# EAGLE design binary_clock (EAGLE 7.7.0)
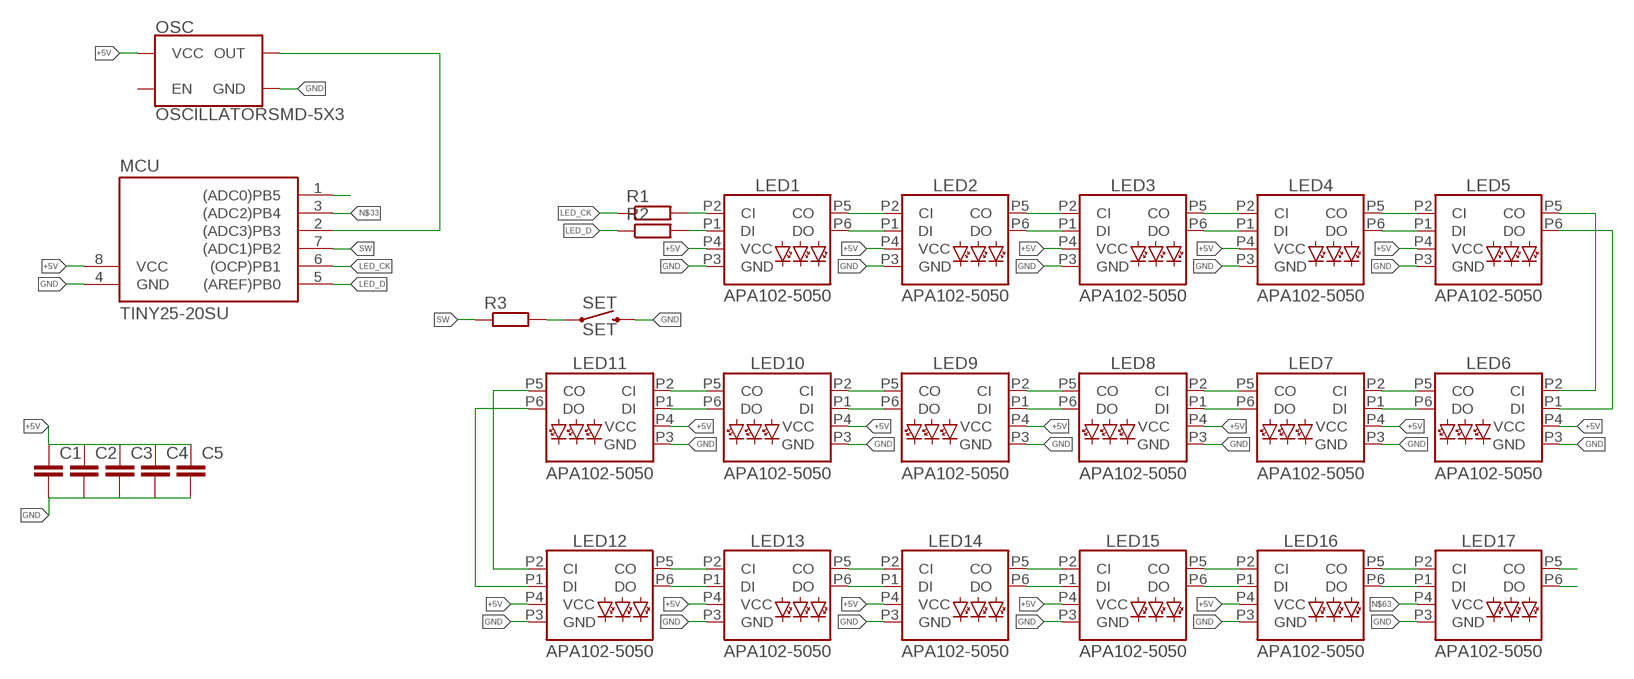
[diagram p0: schematic, sheet 1]

## Parts
C1  C-EUC0603K  [C0603K]
C2  C-EUC0603K  [C0603K]
C3  C-EUC0603K  [C0603K]
C4  C-EUC0603K  [C0603K]
C5  C-EUC0603K  [C0603K]
LED1  APA102-5050  [APA102-5050]
LED2  APA102-5050  [APA102-5050]
LED3  APA102-5050  [APA102-5050]
LED4  APA102-5050  [APA102-5050]
LED5  APA102-5050  [APA102-5050]
LED6  APA102-5050  [APA102-5050]
LED7  APA102-5050  [APA102-5050]
LED8  APA102-5050  [APA102-5050]
LED9  APA102-5050  [APA102-5050]
LED10  APA102-5050  [APA102-5050]
LED11  APA102-5050  [APA102-5050]
LED12  APA102-5050  [APA102-5050]
LED13  APA102-5050  [APA102-5050]
LED14  APA102-5050  [APA102-5050]
LED15  APA102-5050  [APA102-5050]
LED16  APA102-5050  [APA102-5050]
LED17  APA102-5050  [APA102-5050]
MCU  TINY25-20SU  [SOIC8]
OSC  OSCILLATORSMD-5X3  [OSCILLATOR-SMD-5X3.2]
R1  R-EU_R1206  [R1206]
R2  R-EU_R1206  [R1206]
R3  R-EU_R1206  [R1206]
SET  SET  MOMENTARY-SWITCH-SPST-SMD-5.2-REDUNDANT  [TACTILE_SWITCH_SMD_5.2MM]

## Nets
+5V: C1.1 C2.1 C3.1 C4.1 C5.1 LED1.P4(VCC) LED2.P4(VCC) LED3.P4(VCC) LED4.P4(VCC) LED5.P4(VCC) LED6.P4(VCC) LED7.P4(VCC) LED8.P4(VCC) LED9.P4(VCC) LED10.P4(VCC) LED11.P4(VCC) LED12.P4(VCC) LED13.P4(VCC) LED14.P4(VCC) LED15.P4(VCC) LED16.P4(VCC) MCU.8(VCC) OSC.4(VCC)
GND: C1.2 C2.2 C3.2 C4.2 C5.2 LED1.P3(GND) LED2.P3(GND) LED3.P3(GND) LED4.P3(GND) LED5.P3(GND) LED6.P3(GND) LED7.P3(GND) LED8.P3(GND) LED9.P3(GND) LED10.P3(GND) LED11.P3(GND) LED12.P3(GND) LED13.P3(GND) LED14.P3(GND) LED15.P3(GND) LED16.P3(GND) LED17.P3(GND) MCU.4(GND) OSC.2(GND) SET.3 SET.4
LED_CK: MCU.6((OCP)PB1) R1.1
LED_D: MCU.5((AREF)PB0) R2.1
N$1: LED1.P5(CO) LED2.P2(CI)
N$2: LED1.P6(DO) LED2.P1(DI)
N$3: LED2.P5(CO) LED3.P2(CI)
N$4: LED2.P6(DO) LED3.P1(DI)
N$5: LED3.P5(CO) LED4.P2(CI)
N$6: LED3.P6(DO) LED4.P1(DI)
N$7: LED4.P5(CO) LED5.P2(CI)
N$8: LED4.P6(DO) LED5.P1(DI)
N$9: LED10.P5(CO) LED11.P2(CI)
N$10: LED10.P6(DO) LED11.P1(DI)
N$11: LED9.P6(DO) LED10.P1(DI)
N$12: LED9.P5(CO) LED10.P2(CI)
N$13: LED8.P6(DO) LED9.P1(DI)
N$14: LED8.P5(CO) LED9.P2(CI)
N$15: LED7.P6(DO) LED8.P1(DI)
N$16: LED7.P5(CO) LED8.P2(CI)
N$17: LED6.P6(DO) LED7.P1(DI)
N$18: LED6.P5(CO) LED7.P2(CI)
N$19: LED11.P6(DO) LED12.P1(DI)
N$20: LED11.P5(CO) LED12.P2(CI)
N$21: LED12.P5(CO) LED13.P2(CI)
N$22: LED12.P6(DO) LED13.P1(DI)
N$23: LED13.P5(CO) LED14.P2(CI)
N$24: LED13.P6(DO) LED14.P1(DI)
N$25: LED14.P5(CO) LED15.P2(CI)
N$26: LED14.P6(DO) LED15.P1(DI)
N$27: LED15.P5(CO) LED16.P2(CI)
N$28: LED15.P6(DO) LED16.P1(DI)
N$29: LED16.P5(CO) LED17.P2(CI)
N$30: LED16.P6(DO) LED17.P1(DI)
N$31: LED17.P6(DO)
N$32: MCU.1((ADC0)PB5)
N$33: MCU.3((ADC2)PB4)
N$34: LED17.P5(CO)
N$35: MCU.2((ADC3)PB3) OSC.3(OUT)
N$36: R3.2 SET.1 SET.2
N$37: LED5.P6(DO) LED6.P1(DI)
N$38: LED5.P5(CO) LED6.P2(CI)
N$41: LED1.P1(DI) R2.2
N$42: LED1.P2(CI) R1.2
N$63: LED17.P4(VCC)
SW: MCU.7((ADC1)PB2) R3.1
Unconnected: OSC.1(EN)

## Library data of the parts
C1-C5 = rcl:C-EU: CAPACITOR, European symbol
LED1-LED17 = SparkFun-LED:APA102: APA102 Addressable RGB LED Used in manufacturing of various products at SparkFun Packages: 5050 2020 SparkFun Products: SparkFun Lumenati Boards <https://www.sparkfun.com/categories/405>; PROD_ID: DIO-13739
MCU = avr-4:TINY25
OSC = SparkFun-Clocks:OSCILLATOR: Oscillators (Generic) These are active oscillators, which require a power source to generate their clock output. Most oscillators are configured to generate a set frequency (e.g. 16MHz). They have four pins: power, ground, output, and an enable input.
R1-R3 = rcl:R-EU_: RESISTOR, European symbol
SET = SparkFun-Switches:MOMENTARY-SWITCH-SPST: Momentary Switch (Pushbutton) - SPST Normally-open (NO) SPST momentary switches (buttons, pushbuttons). Variants PTH-12MM - 12mm square, through-hole Momentary Pushbutton Switch - 12mm Square <https://www.sparkfun.com/products/9190> (COM-09190) PTH-6.0MM, PTH-6.0MM-KIT - 6.0mm square, through-hole Mini Pushbutton Switch <https://www.sparkfun.com/products/97> (COM-00097) KIT package intended for soldering kit's - only one side of pads' copper is exposed. PTH-RIGHT-ANGLE-KIT - Right-angle, through-hole Right Angle Tactile Button <https://www.sparkfun.com/products/10791> - Used on SparkFun BigTime Watch Kit <https://www.sparkfun.com/products/11734> SMD-12MM - 12mm square, surface-mount Tactile Button - SMD (12mm) <https://www.sparkfun.com/products/12993> (COM-12993) Used on SparkFun PicoBoard <https://www.sparkfun.com/products/11888> SMD-4.5MM - 4.5mm Square Trackball Switch Used on SparkFun Blackberry Trackballer Breakout <https://www.sparkfun.com/products/13169> SMD-4.6MMX2.8MM - 4.60mm x 2.80mm, surface mount Used on SparkFun SAMD21 Mini Breakout <https://www.sparkfun.com/products/13664> SMD-5.2MM, SMD-5.2-REDUNDANT - 5.2mm square, surface-mount Mini Pushbutton Switch - SMD <https://www.sparkfun.com/products/8720> (COM-08720) Used on Arduino Pro Mini <https://www.sparkfun.com/products/11114> REDUNDANT package connects both switch circuits together SMD-6.0X3.5MM - 6.0 x 3.5mm, surface mount Momentary Reset Switch SMD <https://www.sparkfun.com/products/8229> (COM-08229) SMD-6.2MM-TALL - 6.2mm square, surface mount Tactile Button - SMD (6mm) <https://www.sparkfun.com/products/12992> Used on SparkFun Digital Sandbox <https://www.sparkfun.com/products/12651> SMD-RIGHT-ANGLE - Right-angle, surface mount Used on SparkFun Block for Intel® Edison - Arduino <https://www.sparkfun.com/products/13036>; PROD_ID: SWCH-08247; SF_SKU: COM-08720

## Board
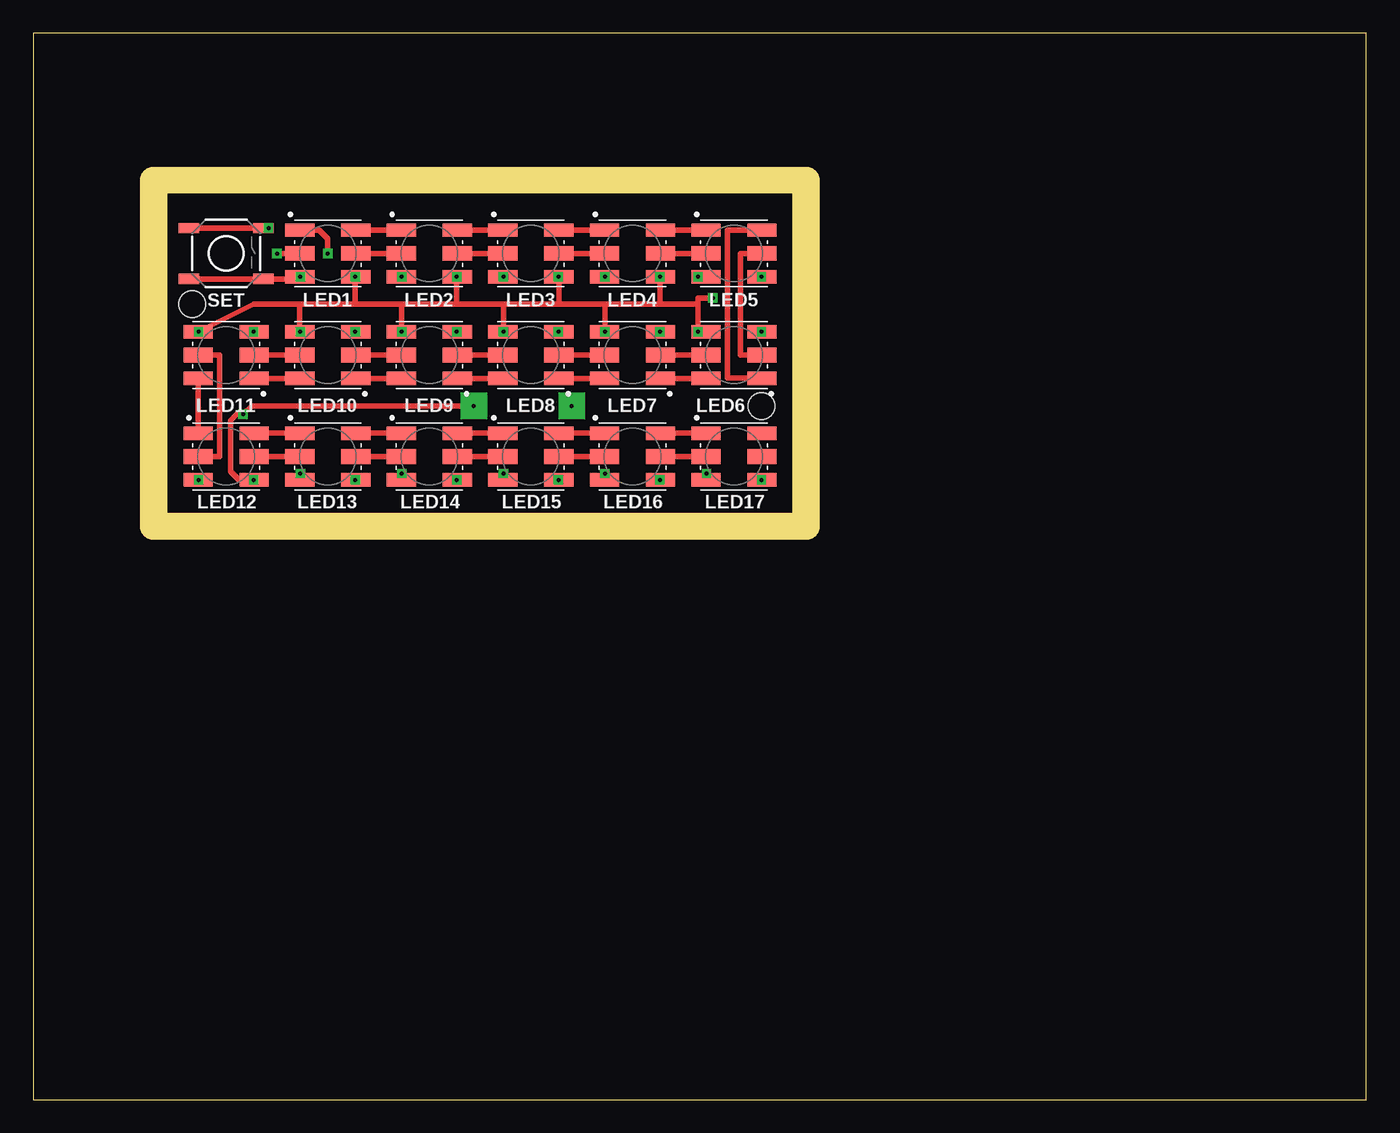
[diagram p1: board, top side]
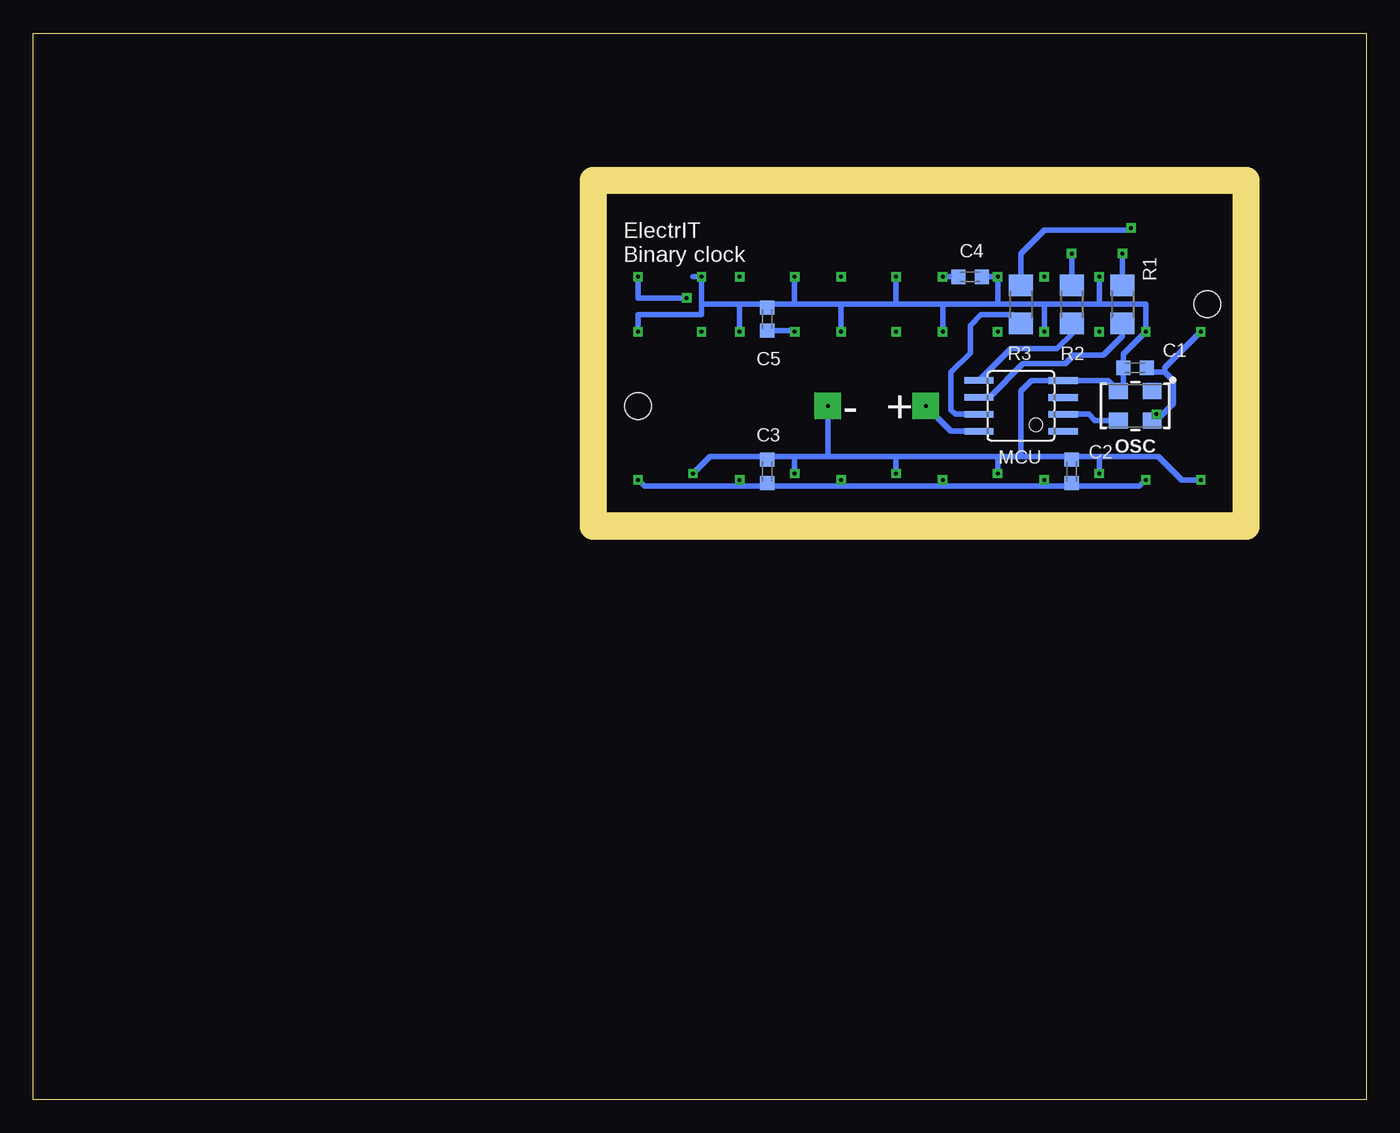
[diagram p2: board, bottom side, seen from below]

Size 100 x 80 mm. Coordinates in mm from the lower left corner, seen from the top.
Outline: 0,0 100,0 100,80 0,80 0,0
Outline: 57,44 57,68 10,68 10,44 57,44
Copper layers (1*16): Top 0.035mm / dielectric 1.5mm / Bottom 0.035mm
Design rules "default": minimum track width 10mil, minimum drill 24mil, track to track 8mil, track to pad 8mil, pad to pad 8mil, via to via 8mil, smd to smd 8mil, copper to edge 40mil, drill to drill 8mil, minimum pad ring 10mil, minimum via ring 8mil, stop-mask expansion 4mil, vias tented up to drill 0mil, thermal gap 10mil
Holes 2 mm at 54.63,52.05 11.93,59.67
Milling: 4 lines

### Footprints (pad centres in the part's own frame; a part is rotated, then mirrored left to right if it is on the bottom)
C0603K = smd 1.05 x 1.08: 1 -0.875,0; 2 0.875,0
APA102-5050 = smd 1 x 2.2: P1 -1.75,-2.1; P3 1.75,-2.1; P4 1.75,2.1; P6 -1.75,2.1 | smd 1.1 x 2.2: P2 0,-2.1; P5 0,2.1
SOIC8 = smd 0.5 x 2.2: 1 -1.905,-3.154; 2 -0.645,-3.154; 3 0.625,-3.154; 4 1.895,-3.154; 5 1.905,3.154; 6 0.635,3.154; 7 -0.635,3.154; 8 -1.905,3.154
OSCILLATOR-SMD-5X3.2 = smd 1.397 x 1.194: 1 -1.27,-1.1; 2 1.27,-1.1; 3 1.27,1.1; 4 -1.27,1.1
R1206 = smd 1.6 x 1.803: 1 -1.422,0; 2 1.422,0
TACTILE_SWITCH_SMD_5.2MM = smd 1.524 x 0.762: 1 -2.794,1.905; 2 2.794,1.905; 3 -2.794,-1.905; 4 2.794,-1.905

### Placement (x,y rotation side)
C1  17.33,54.91 180 bottom
C2  22.09,47.13 90 bottom
C3  44.95,47.13 90 bottom
C4  29.71,61.73 0 bottom
C5  44.95,58.56 90 bottom
LED1  22.09,63.48 270 top
LED2  29.71,63.48 270 top
LED3  37.33,63.48 270 top
LED4  44.95,63.48 270 top
LED5  52.57,63.48 270 top
LED6  52.57,55.86 90 top
LED7  44.95,55.86 90 top
LED8  37.33,55.86 90 top
LED9  29.71,55.86 90 top
LED10  22.09,55.86 90 top
LED11  14.47,55.86 90 top
LED12  14.47,48.24 270 top
LED13  22.09,48.24 270 top
LED14  29.71,48.24 270 top
LED15  37.33,48.24 270 top
LED16  44.95,48.24 270 top
LED17  52.57,48.24 270 top
MCU  25.9,52.05 90 bottom
OSC  17.33,52.05 180 bottom
R1  18.28,59.67 90 bottom
R2  22.09,59.67 90 bottom
R3  25.9,59.67 90 bottom
SET  14.47,63.48 0 top

### Tracks (layer width: path | path; a pad name or v marks a point on that pad's centre or on a via)
+5V  (via drill 0.3 pad 0.3, 0.3 pad 2)
  Top 0.406: 19.99,59.67 LED10.P4 v20.03,57.61 | 19.99,59.67 24.15,59.67 | 24.15,59.67 27.65,59.67 | 27.65,59.67 31.77,59.67 | 31.77,59.67 35.27,59.67 | 35.27,59.67 39.43,59.67 | 39.43,59.67 42.89,59.67 | 42.89,59.67 47.01,59.67 | 47.01,59.67 49.87,59.67 | 47.01,59.67 v47.01,61.73 v47.02,61.73 LED4.P4 | 39.43,59.67 LED3.P4 v39.4,61.73 v39.39,61.73 | 31.77,59.67 v31.77,61.73 v31.78,61.73 LED2.P4 | 24.15,59.67 v24.15,61.73 v24.16,61.73 LED1.P4 | 27.65,59.67 v27.65,57.61 LED9.P4 | 35.27,59.67 v35.27,57.61 v35.26,57.61 LED8.P4 | 42.89,59.67 v42.89,57.61 LED7.P4 | 19.99,59.67 16.53,59.67 v12.41,57.61 LED11.P4 | v54.63,61.73 LED5.P4 | v16.53,46.49 LED12.P4 15.43,46.49 14.79,47.13 14.79,50.94 15.26,51.41 v15.74,51.41 16.38,52.05 v33.04,52.05 | LED13.P4 v24.15,46.49 | LED14.P4 v31.77,46.49 | LED15.P4 v39.39,46.49 | LED16.P4 v47.01,46.49 | 49.87,59.67 v49.87,57.61 LED6.P4 | 49.87,59.67 49.87,60.15 v50.98,60.15
  Bottom 0.406: 15.11,54.59 14.47,53.95 14.47,52.21 15.73,50.95 OSC.4 15.74,51.27 v15.74,51.41 | 15.11,54.59 16.14,54.59 C1.1 | v16.53,46.49 17.01,46.02 22.09,46.02 | 22.09,46.02 24.15,46.02 | 24.15,46.02 31.77,46.02 | 31.77,46.02 39.39,46.02 | 39.39,46.02 45.11,46.02 | 45.11,46.02 47.01,46.02 | 47.01,46.02 54.16,46.02 v54.63,46.49 | v47.01,46.49 47.01,46.02 | v39.39,46.49 39.39,46.02 | v31.77,46.49 31.77,46.02 | v24.15,46.49 24.15,46.02 | 15.11,54.59 15.11,54.91 v12.41,57.61 | MCU.8 31.14,50.15 v33.04,52.05 | C3.1 45.11,46.25 45.11,46.02 | C2.1 22.09,46.02 | C5.1 42.89,57.68 v42.89,57.61 | C4.1 v31.77,61.73 | v50.98,60.15 54.63,60.15 v54.63,61.73
GND  (via drill 0.3 pad 0.3, 0.3 pad 2)
  Top 0.406: LED1.P3 v20.02,61.73 v20.03,61.73 20.03,61.58 SET.4 SET.3 | v27.65,61.73 LED2.P3 | v35.27,61.73 LED3.P3 | v39.39,57.61 LED8.P3 | v31.77,57.61 LED9.P3 | v24.15,57.61 LED10.P3 | LED7.P3 v47.02,57.61 v47.01,57.61 | v54.63,57.61 LED6.P3 | LED5.P3 50.5,61.73 v49.87,61.73 | v42.89,61.73 LED4.P3 | v50.51,46.97 50.51,46.53 LED17.P3 | v42.89,46.97 42.89,46.53 LED16.P3 | v35.27,46.97 35.27,46.53 LED15.P3 | v27.65,46.97 27.65,46.53 LED14.P3 | v20.03,46.97 20.03,46.53 LED13.P3 | LED11.P3 v16.54,57.61 v16.53,57.61 | LED12.P3 v12.4,46.49 v12.41,46.49
  Bottom 0.406: 20.03,59.67 16.53,59.67 v16.53,57.61 18.2,55.94 C1.2 18.2,53.55 OSC.2 19.39,53.95 MCU.4 25.12,53.95 25.9,53.16 25.9,48.24 | 20.03,59.67 24.15,59.67 | 24.15,59.67 27.65,59.67 | 27.65,59.67 31.77,59.67 | 31.77,59.67 35.27,59.67 | 35.27,59.67 39.39,59.67 | 39.39,59.67 42.89,59.67 | 42.89,59.67 44.95,59.67 | 44.95,59.67 47.01,59.67 | 47.01,59.67 49.87,59.67 | 50.5,61.73 v49.87,61.73 49.87,59.67 | v42.89,61.73 42.89,59.67 | 27.65,59.67 v27.65,61.73 C4.2 | v12.41,46.49 13.84,46.49 15.58,48.24 20.03,48.24 | 20.03,48.24 22.09,48.24 | 22.09,48.24 25.9,48.24 | 25.9,48.24 27.65,48.24 | 27.65,48.24 35.27,48.24 | 35.27,48.24 40.39,48.24 | 40.39,48.24 42.89,48.24 | 42.89,48.24 44.95,48.24 | 44.95,48.24 49.24,48.24 v50.51,46.97 | v20.03,46.97 20.03,48.24 | v27.65,46.97 27.65,48.24 | v35.27,46.97 35.27,48.24 | v42.89,46.97 42.89,48.24 | v35.27,61.73 35.27,59.67 | v20.03,61.73 20.03,59.67 | v24.15,57.61 24.15,59.67 | v31.77,57.61 31.77,59.67 | v39.39,57.61 39.39,59.67 | v47.01,57.61 47.01,59.67 | v54.63,57.61 54.63,58.88 49.87,58.88 49.87,59.67 | v40.39,52.05 40.39,48.24 | C3.2 44.95,48.24 | C2.2 22.09,48.24 | C5.2 44.95,59.67
LED_CK
  Bottom 0.406: R1.1 18.28,57.29 19.71,55.86 21.93,55.86 22.57,55.23 25.74,55.23 28.28,52.69 MCU.6
LED_D
  Bottom 0.406: R2.1 22.09,57.45 23.2,56.34 26.67,56.34 MCU.5
N$1
  Top 0.406: LED1.P5 LED2.P2
N$2
  Top 0.406: LED1.P6 LED2.P1
N$3
  Top 0.406: LED2.P5 LED3.P2
N$4
  Top 0.406: LED2.P6 LED3.P1
N$5
  Top 0.406: LED3.P5 LED4.P2
N$6
  Top 0.406: LED3.P6 LED4.P1
N$7
  Top 0.406: LED4.P5 LED5.P2
N$8
  Top 0.406: LED4.P6 LED5.P1
N$9
  Top 0.406: LED10.P5 LED11.P2
N$10
  Top 0.406: LED10.P6 LED11.P1
N$11
  Top 0.406: LED9.P6 LED10.P1
N$12
  Top 0.406: LED9.P5 LED10.P2
N$13
  Top 0.406: LED8.P6 LED9.P1
N$14
  Top 0.406: LED8.P5 LED9.P2
N$15
  Top 0.406: LED7.P6 LED8.P1
N$16
  Top 0.406: LED7.P5 LED8.P2
N$17
  Top 0.406: LED6.P6 LED7.P1
N$18
  Top 0.406: LED6.P5 LED7.P2
N$19
  Top 0.406: 13.2,49.99 LED12.P1 LED11.P6
N$20
  Top 0.406: LED12.P2 13.99,48.24 13.99,55.86 LED11.P5
N$21
  Top 0.406: LED12.P5 LED13.P2
N$22
  Top 0.406: LED12.P6 LED13.P1
N$23
  Top 0.406: LED13.P5 LED14.P2
N$24
  Top 0.406: LED13.P6 LED14.P1
N$25
  Top 0.406: LED14.P5 LED15.P2
N$26
  Top 0.406: LED14.P6 LED15.P1
N$27
  Top 0.406: LED15.P5 LED16.P2
N$28
  Top 0.406: LED15.P6 LED16.P1
N$29
  Top 0.406: LED16.P5 LED17.P2
N$30
  Top 0.406: LED16.P6 LED17.P1
N$35
  Bottom 0.406: OSC.3 20.36,50.95 20.82,51.41 22.74,51.41 MCU.2
N$36  (via drill 0.3 pad 0.61)
  Top 0.406: SET.1 SET.2 v17.64,65.39
  Bottom 0.406: v17.64,65.39 17.8,65.23 24.15,65.23 25.9,63.48 R3.2
N$37
  Top 0.406: LED5.P6 52.09,65.23 52.09,54.11 LED6.P1
N$38
  Top 0.406: LED5.P5 53.05,63.48 53.05,55.86 LED6.P2
N$41  (via drill 0.3 pad 0.3)
  Top 0.406: v22.09,63.48 22.09,64.59 21.45,65.23 LED1.P1
  Bottom 0.406: R2.2 v22.09,63.48
N$42  (via drill 0.3 pad 0.3)
  Top 0.406: v18.28,63.48 LED1.P2
  Bottom 0.406: R1.2 v18.28,63.48
SW
  Bottom 0.406: R3.1 26.54,58.88 28.92,58.88 29.71,58.08 29.71,56.02 31.14,54.59 31.14,51.73 30.82,51.41 MCU.7

### Text on the board
bNames: ElectrIT / Binary clock | + | -